# EAGLE design Grove - Gas Sensor(O2) v1.1 (EAGLE 6.4)
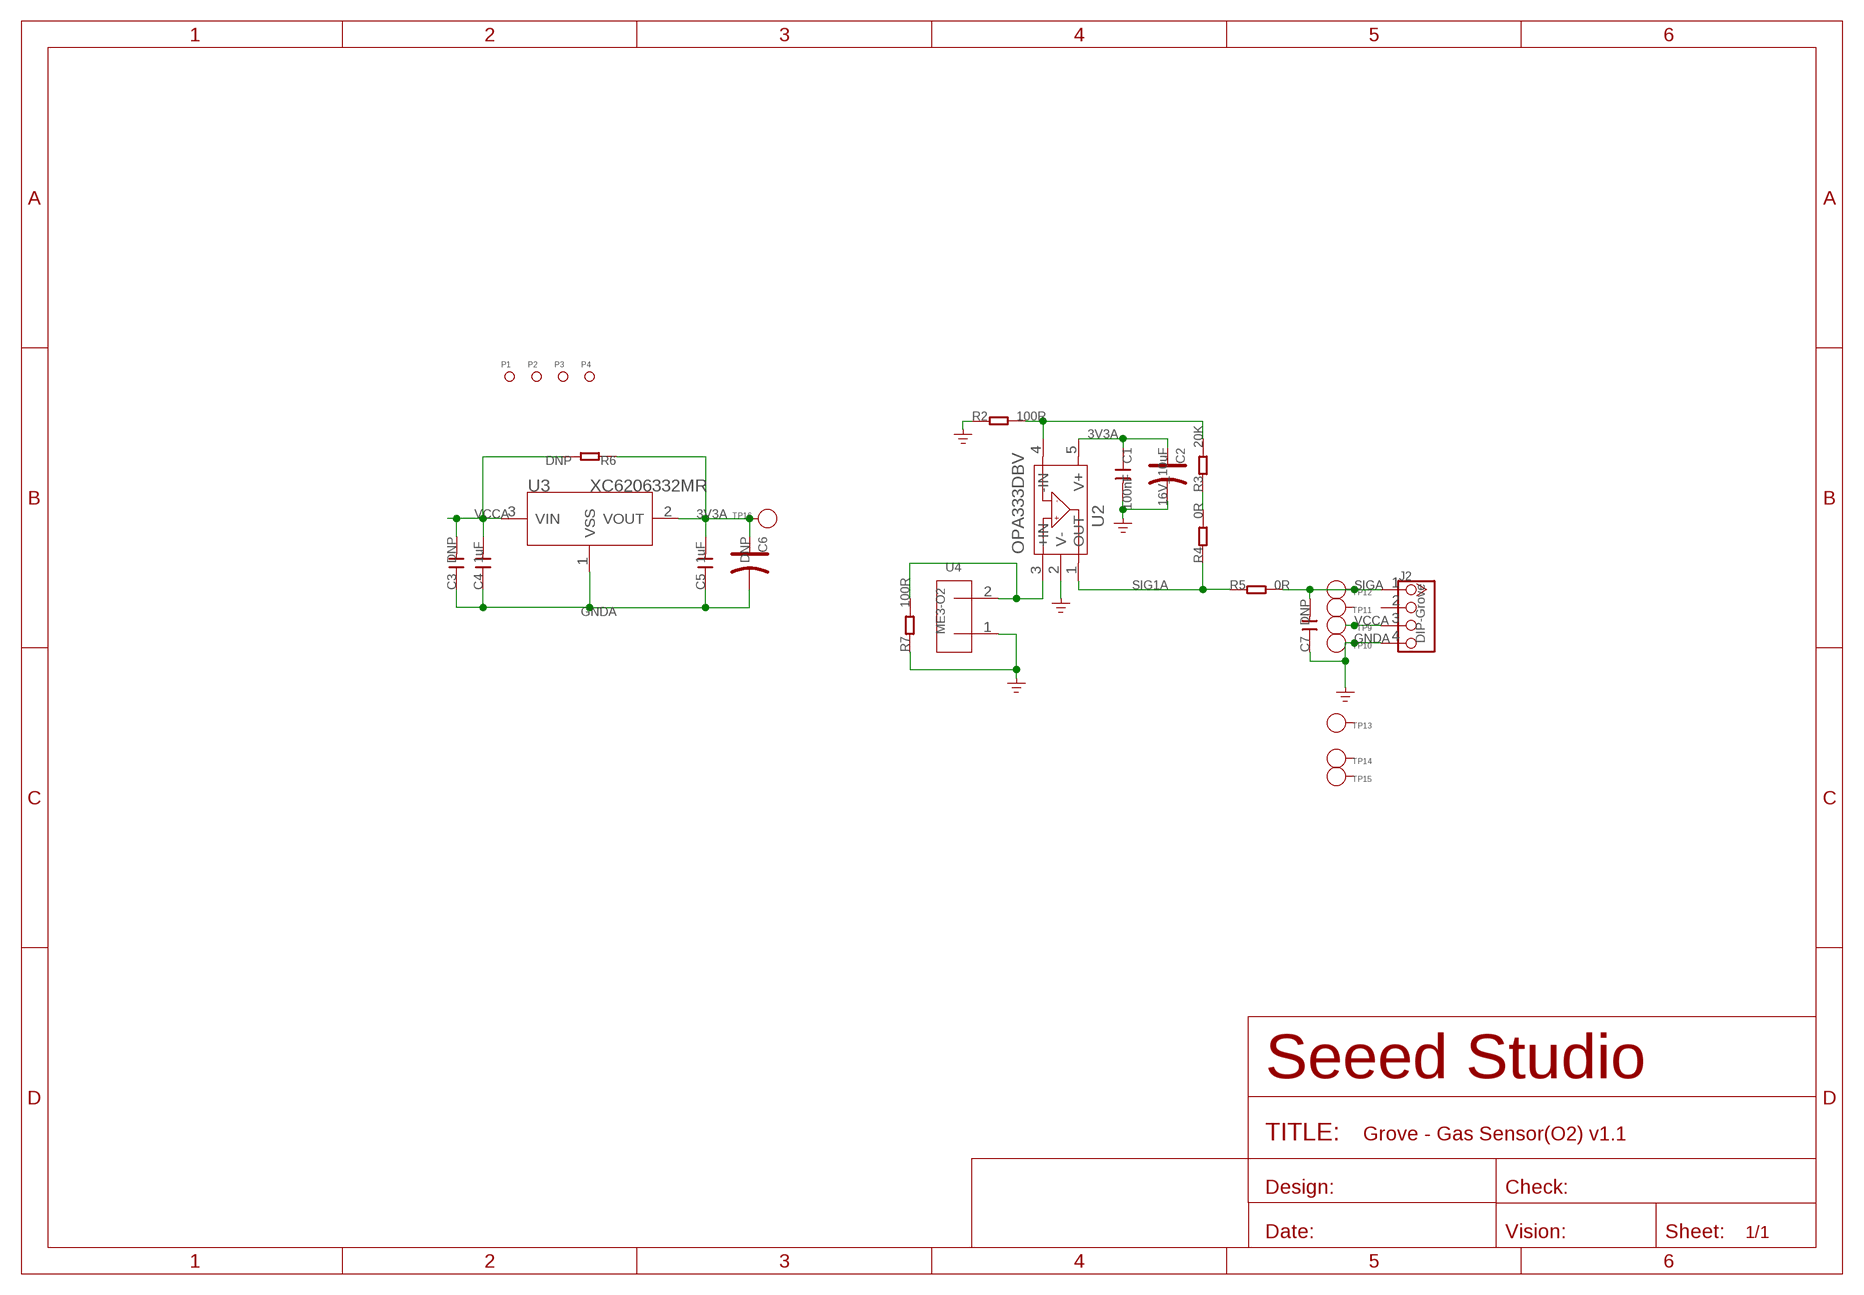
[diagram p0: schematic, sheet 1]

## Parts
C1  100nF  C-0603  [C0603]
C2  16V_10uF  CAP-AVX-A  [AVX-A]
C3  DNP  C-0805  [C0805]
C4  1uF  C-0603  [C0603]
C5  1uF  C-0603  [C0603]
C6  DNP  CAP-AVX-A  [AVX-A]
C7  DNP  C-0805  [C0805]
J2  DIP-Grove  TWIG-4P-2.0-2.0  [4P-2.0]
P1  PAD-MARK'ANNULAR'  [ROUND-MARK-1.0]
P2  PAD-MARK'ANNULAR'  [ROUND-MARK-1.0]
P3  PAD-MARK'ANNULAR'  [ROUND-MARK-1.0]
P4  PAD-MARK'ANNULAR'  [ROUND-MARK-1.0]
R2  100R  R-0603  [R0603]
R3  20K  R-0603  [R0603]
R4  0R  R-0603  [R0603]
R5  0R  R-0603  [R0603]
R6  DNP  R-0603  [R0603]
R7  100R  R-0603  [R0603]
TP9  PAD-TEST-POINT'4545'  [TP_4545]
TP10  PAD-TEST-POINT'4545'  [TP_4545]
TP11  PAD-TEST-POINT'4545'  [TP_4545]
TP12  PAD-TEST-POINT'4545'  [TP_4545]
TP13  PAD-TEST-POINT'4545'  [TP_4545]
TP14  PAD-TEST-POINT'4545'  [TP_4545]
TP15  PAD-TEST-POINT'4545'  [TP_4545]
TP16  PAD-TEST-POINT'4545'  [TP_4545]
U2  OPA333DBV  [SOT23-5]
U3  XC6206332MR  XC6206MR  [SOT23]
U4  ME3-O2  [2P-D20X16H]

## Nets
3V3A: C1.1 C2.+ C5.2 C6.+ R6.1 TP16.T U2.5(V+) U3.2(VOUT)
GNDA: C1.2 C2.- C3.1 C4.1 C5.1 C6.- C7.1 J2.4 R2.1 R7.1 TP10.T U2.2(V-) U3.1(VSS) U4.1
N$3: R7.2 U2.3(+IN) U4.2
N$4: R2.2 R3.2 U2.4(-IN)
N$6: R3.1 R4.2
SIG1A: R4.1 R5.1 U2.1(OUT)
SIGA: C7.2 J2.1 R5.2 TP12.T
VCCA: C3.2 C4.2 J2.3 R6.2 TP9.T U3.3(VIN)
Unconnected: J2.2 TP11.T TP13.T TP14.T TP15.T

## Library data of the parts
C1 C3-C5 C7 = Discrete:C*: Ceramic Capacitors
C2 C6 = Discrete:CAP*: Electrolytic Capacitors,Tantalum Capacitors and Super Capacitors
J2 = Connector:TWIG-4P-2.0
P1-P4 = Discrete:PAD-MARK; PARTNO: DNP
R2-R7 = Discrete:R*
TP9-TP16 = Discrete:PAD-TEST-POINT; PARTNO: DNP
U2 = IC:OPA333: 1.8V,Micro power CMOS oprational amplifiers Zero-Drift Series http://www.ti.com.cn/cn/lit/ds/symlink/opa333.pdf
U3 = IC:XC6206: LOW ESR Cap.Compatible Positive Voltage Regulators
U4 = template:ME3-O2

## Board
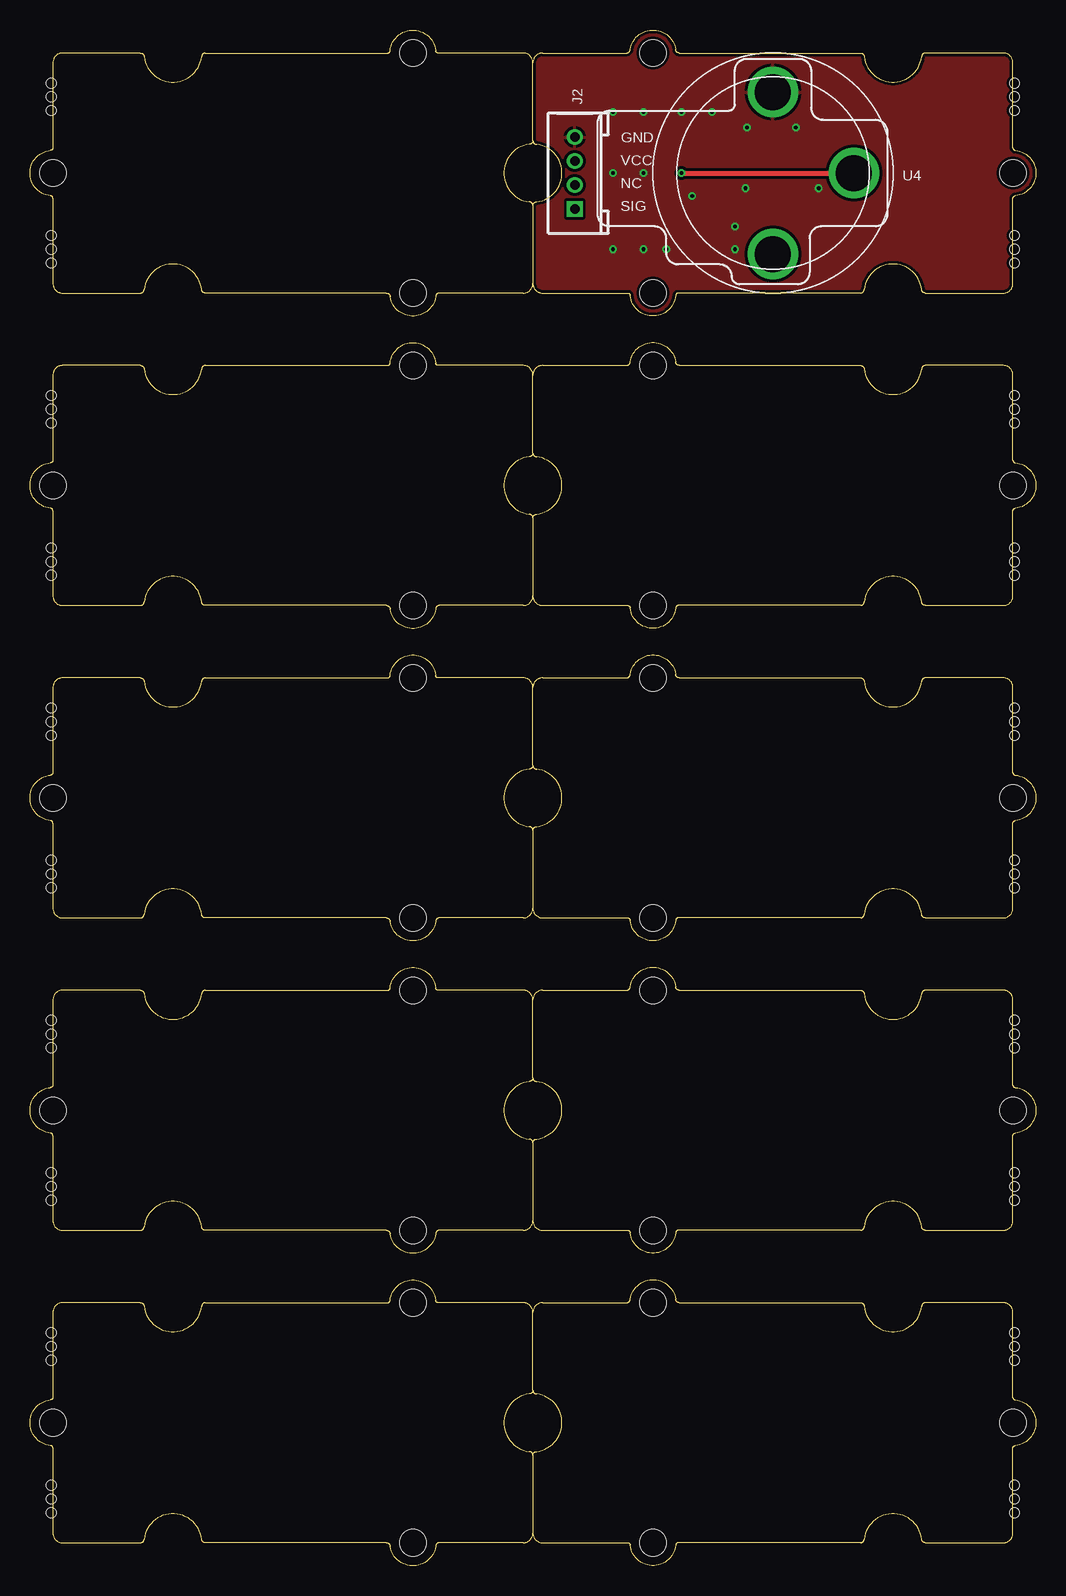
[diagram p1: board, top side]
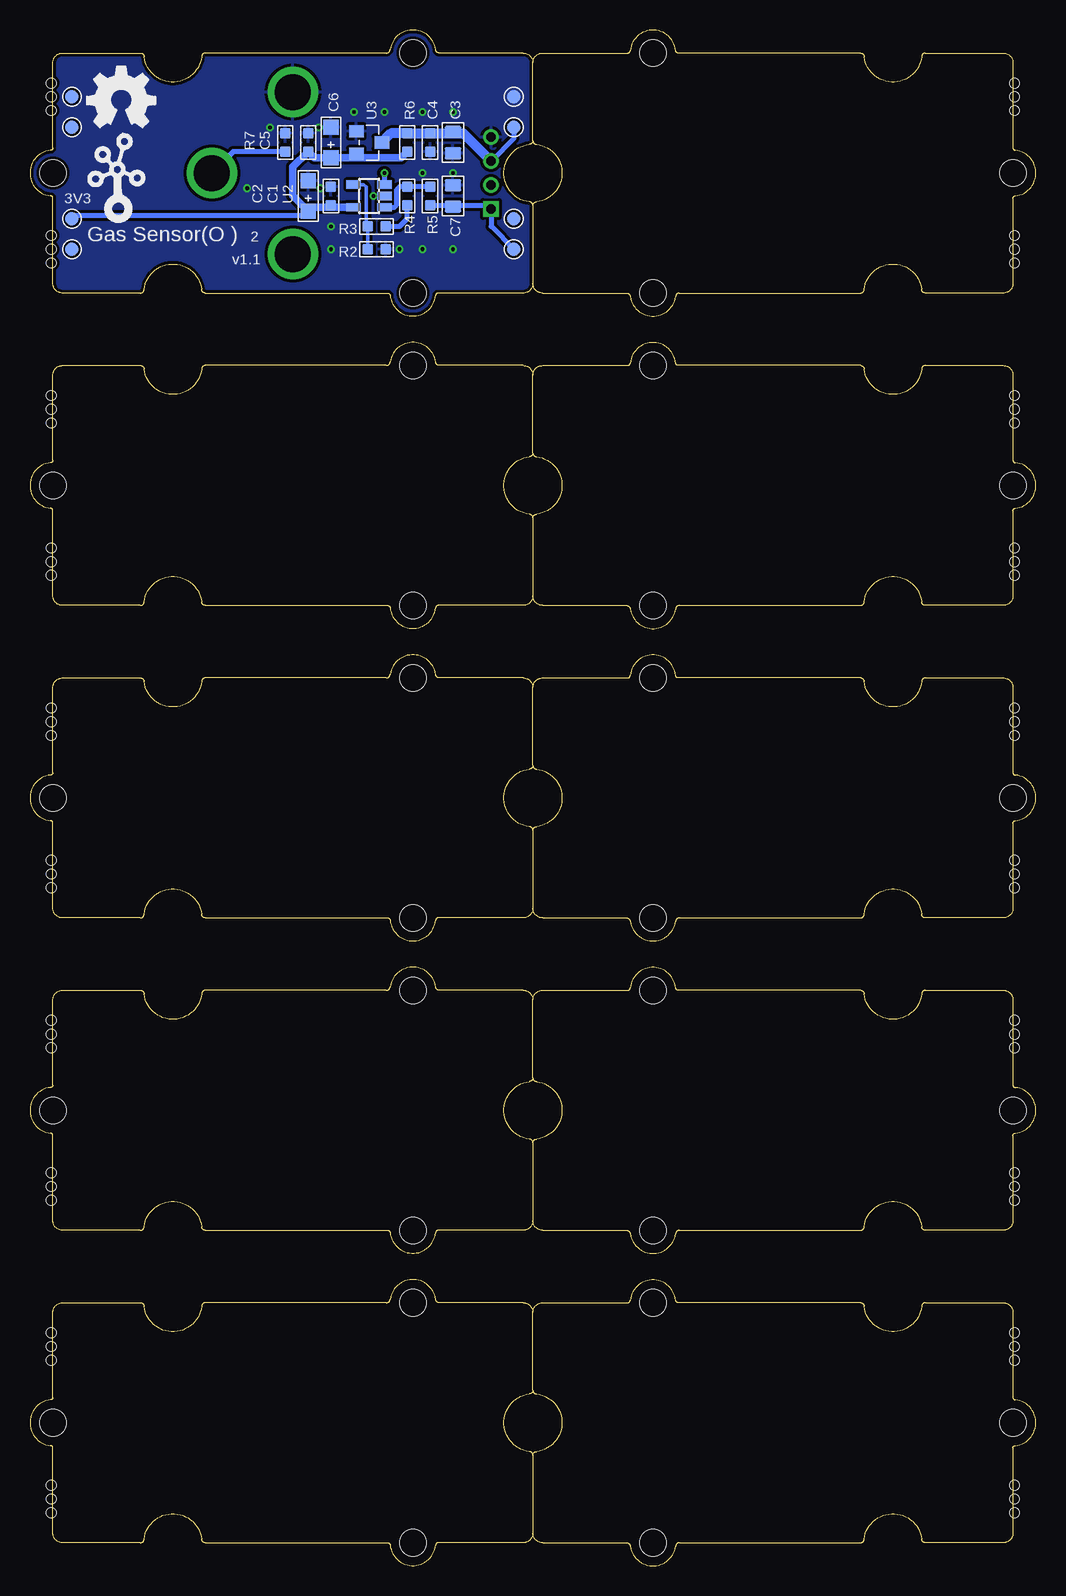
[diagram p2: board, bottom side, seen from below]

Size 83.82 x 127.98 mm. Coordinates in mm from the lower left corner, seen from the top.
Copper layers (1*16): Top 0.035mm / dielectric 1.5mm / Bottom 0.035mm
Design rules "SeeedStudio_2layer_DRU_no_angle_20140221 *": minimum track width 6mil, minimum drill 12mil, track to track 6mil, track to pad 6mil, pad to pad 6mil, via to via 6mil, smd to smd 0mil, copper to edge 10mil, drill to drill 10mil, minimum pad ring 10mil, minimum via ring 6mil, stop-mask expansion 2mil, vias tented up to drill 100mil, thermal gap 10mil
Holes 0.8 mm at 1.78,123.55 1.78,121.27 1.78,122.41 1.78,110.85 1.78,108.57 1.78,109.71 1.78,97.52 1.78,95.23 1.78,96.38 1.78,84.82 1.78,82.53 1.78,83.68 1.78,71.48 1.78,69.2 1.78,70.34 1.78,58.78 1.78,56.5 1.78,57.64 1.78,45.45 1.78,43.16 1.78,44.31 1.78,32.75 1.78,30.46 1.78,31.61 1.78,19.41 1.78,17.13 1.78,18.27 1.78,6.71 1.78,4.43 1.78,5.57 82.04,121.27 82.04,123.55 82.04,122.41 82.04,108.57 82.04,110.85 82.04,109.71 82.04,95.23 82.04,97.52 82.04,96.38 82.04,82.53 82.04,84.82 82.04,83.68 82.04,69.2 82.04,71.48 82.04,70.34 82.04,56.5 82.04,58.78 82.04,57.64 82.04,43.16 82.04,45.45 82.04,44.31 82.04,30.46 82.04,32.75 82.04,31.61 82.04,17.13 82.04,19.41 82.04,18.27 82.04,4.43 82.04,6.71 82.04,5.57
Holes 1.91 mm at -4.13,2.4 87.95,2.4 87.95,125.59 -4.13,125.59

### Footprints (pad centres in the part's own frame; a part is rotated, then mirrored left to right if it is on the bottom)
C0603 = smd 0.889 x 0.889: 1 -0.762,0; 2 0.762,0
AVX-A = smd 1.27 x 1.27: + -1.27,0; - 1.27,0
C0805 = smd 1.016 x 1.397: 1 -0.889,0; 2 0.889,0
4P-2.0 = drill 0.8 pad 1.27 square: 1 -3,0 | drill 0.8 pad 1.27: 2 -1,0; 3 1,0; 4 3,0
ROUND-MARK-1.0 = smd 1.016 x 1.016: P$1 0,0
R0603 = smd 0.889 x 0.889: 1 -0.762,0; 2 0.762,0
TP_4545 = smd 1.143 x 1.143: T 0,0
SOT23-5 = smd 0.69 x 1.2: 1 -0.95,-1.3; 2 0,-1.3; 3 0.95,-1.3; 4 0.95,1.3; 5 -0.95,1.3
SOT23 = smd 1.016 x 1.2: 1 -0.95,-1.06; 2 0.95,-1.06; 3 0,1.06
2P-D20X16H = drill 3 pad 4.2: 1 6.75,0; 2 0,-6.75; 3 -6.75,0
GROVE-TEST-PLATFORM = hole 2.2: -10,-10; -10,10; 20,0

### Placement (x,y rotation side)
C1  58.74,114.16 90 bottom
C2  60.64,114.16 90 bottom
C3  48.58,118.6 90 bottom
C4  50.48,118.6 90 bottom
C5  60.64,118.6 270 bottom
C6  58.74,118.6 90 bottom
C7  48.58,114.16 270 bottom
J2  45.4,116.06 90 top
P1  -4.13,7.48 0 top  (outside the outline)
P2  87.95,7.48 0 top  (outside the outline)
P3  -4.13,120.51 0 top  (outside the outline)
P4  87.95,120.51 0 top  (outside the outline)
R2  54.93,109.71 180 bottom
R3  54.93,111.62 180 bottom
R4  52.39,114.16 270 bottom
R5  50.48,114.16 270 bottom
R6  52.39,118.6 90 bottom
R7  62.55,118.6 270 bottom
TP9  43.5,119.87 0 bottom
TP10  43.5,122.41 0 bottom
TP11  43.5,112.25 0 bottom
TP12  43.5,109.71 0 bottom
TP13  80.33,109.71 0 bottom
TP14  80.33,119.87 0 bottom
TP15  80.33,122.41 0 bottom
TP16  80.33,112.25 0 bottom
U2  55.56,114.16 90 bottom
U3  55.56,118.6 270 bottom
U4  61.91,116.06 90 top
U$1  [GROVE-TEST-PLATFORM]  61.91,116.06 0 top
U$2  [GROVE-TEST-PLATFORM]  21.91,116.06 180 top
U$3  [GROVE-TEST-PLATFORM]  21.91,90.03 180 top
U$4  [GROVE-TEST-PLATFORM]  61.91,90.03 0 top
U$5  [GROVE-TEST-PLATFORM]  21.91,63.99 180 top
U$6  [GROVE-TEST-PLATFORM]  61.91,63.99 0 top
U$8  [GROVE-TEST-PLATFORM]  21.91,37.96 180 top
U$14  [GROVE-TEST-PLATFORM]  61.91,37.96 0 top
U$15  [OSHW_FILLX200_NOTEXT]  79.06,119.87 0 bottom
U$16  [GROVE-TEST-PLATFORM]  21.91,11.92 180 top
U$17  [TWIGLOGO]  76.52,112.89 0 bottom
U$18  [GROVE-TEST-PLATFORM]  61.91,11.92 0 top

### Tracks (layer width: path | path; a pad name or v marks a point on that pad's centre or on a via)
3V3A
  Bottom 0.406: C2.+ 60.64,112.76 60.77,112.63 60.77,112.51 79.95,112.51 80.2,112.25 TP16.T
  Bottom 0.61: 56.58,117.33 C6.+ 60.14,117.33 C5.2 61.91,116.57 61.91,114.16 C2.+ 60.32,113.21 58.93,113.21 | 56.58,117.33 52.9,117.33 R6.1 | U3.2 56.62,117.38 56.58,117.33 | U2.5 58.93,113.21 | 58.93,113.21 C1.1
GNDA  (via drill 0.3 pad 0.64)
  other vias: 56.83,121.14 48.58,116.06 51.12,116.06 53.02,109.71 51.12,109.71 48.58,109.71 54.29,121.14 51.12,121.14 59.63,114.79 59.75,119.87 65.72,114.79 63.82,119.87 48.58,121.14 58.74,109.71 55.18,114.16 58.74,111.62
  pour Top (isolate 0.254): 41.59,128.13 84.14,128.13 84.14,105.27 84.14,104 41.59,104
  pour Bottom (isolate 0.254): 41.59,128.13 84.14,128.13 84.14,105.27 84.14,104 41.59,104
N$3  (via drill 0.3 pad 0.64)
  Top 0.406: v54.29,116.06 U4.2
  Bottom 0.406: R7.2 66.89,117.84 U4.2 | U2.3 54.26,116.03 v54.29,116.06
N$4
  Bottom 0.305: U2.4 56.01,115.11 55.82,114.92 55.82,111.62 R3.2 R2.2
N$6
  Bottom 0.406: R3.1 53.02,111.62 52.39,112.25 R4.2
SIG1A
  Bottom 0.406: R5.1 R4.1 53.02,114.92 53.28,114.66 53.28,113.39 53.47,113.21 U2.1
SIGA
  Bottom 0.406: TP12.T 45.4,111.62 J2.1 45.74,113.39 48.71,113.39 | R5.2 48.71,113.39 | 48.71,113.39 C7.2
VCCA
  Bottom 0.406: TP9.T 43.5,118.97 J2.3
  Bottom 0.813: 48.71,119.36 C4.2 R6.2 53.74,119.36 U3.3 | 48.71,119.36 C3.2 | 48.71,119.36 47.71,119.36 J2.3

### Text on the board
tPlace: GND | VCC | NC | SIG
bPlace: 3V3 | 2 | Gas Sensor(O ) | v1.1